# EAGLE design PiHAT_SSR_V4 (EAGLE 9.2.2)

## Sheet 1 of 4: Raspberry Pi GPIO pin layout schematc
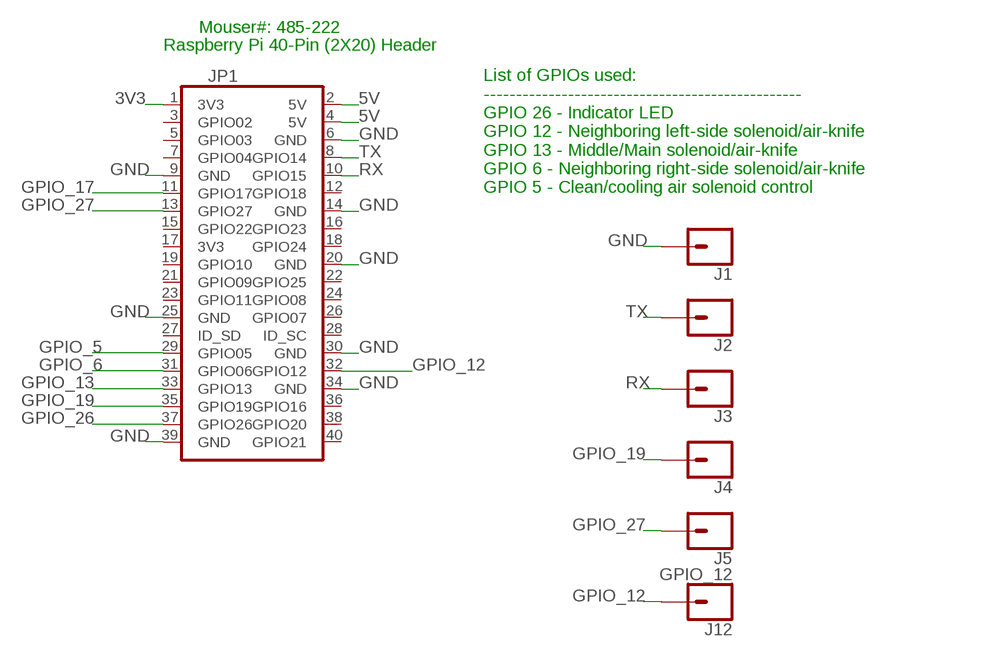
[diagram p0: schematic, sheet 1]

### Parts
J1  CONN_01  [1X01]
J2  CONN_01  [1X01]
J3  CONN_01  [1X01]
J4  CONN_01  [1X01]
J5  CONN_01  [1X01]
J12  GPIO_12  CONN_01  [1X01]
JP1  40W_PI_HAT_TPH  [2X20]

### Nets
3V3: JP1.1(3V3) ; also sheet 2
5V: JP1.2(5V) JP1.4(5V) ; also sheet 3
GND: J1.1 JP1.6(GND) JP1.9(GND) JP1.14(GND) JP1.20(GND) JP1.25(GND) JP1.30(GND) JP1.34(GND) JP1.39(GND) ; also sheet 2,3,4
GPIO_5: JP1.29(GPIO05) ; also sheet 2
GPIO_6: JP1.31(GPIO06) ; also sheet 2
GPIO_12: J12.1 JP1.32(GPIO12)
GPIO_13: JP1.33(GPIO13) ; also sheet 2
GPIO_17: JP1.11(GPIO17) ; also sheet 2
GPIO_19: J4.1 JP1.35(GPIO19)
GPIO_26: JP1.37(GPIO26)
GPIO_27: J5.1 JP1.13(GPIO27)
RX: J3.1 JP1.10(GPIO15)
TX: J2.1 JP1.8(GPIO14)
Unconnected: JP1.3(GPIO02) JP1.5(GPIO03) JP1.7(GPIO04) JP1.12(GPIO18) JP1.15(GPIO22) JP1.16(GPIO23) JP1.17(3V3) JP1.18(GPIO24) JP1.19(GPIO10) JP1.21(GPIO09) JP1.22(GPIO25) JP1.23(GPIO11) JP1.24(GPIO08) JP1.26(GPIO07) JP1.27(ID_SD) JP1.28(ID_SC) JP1.36(GPIO16) JP1.38(GPIO20) JP1.40(GPIO21)

### Notes on the sheet
- Mouser#: 485-222
- Raspberry Pi 40-Pin (2X20) Header
- List of GPIOs used:
  -------------------------------------------------
  GPIO 26 - Indicator LED
  GPIO 12 - Neighboring left-side solenoid/air-knife
  GPIO 13 - Middle/Main solenoid/air-knife
  GPIO 6 - Neighboring right-side solenoid/air-knife
  GPIO 5 - Clean/cooling air solenoid control

## Sheet 2 of 4: Solid State Relay layout
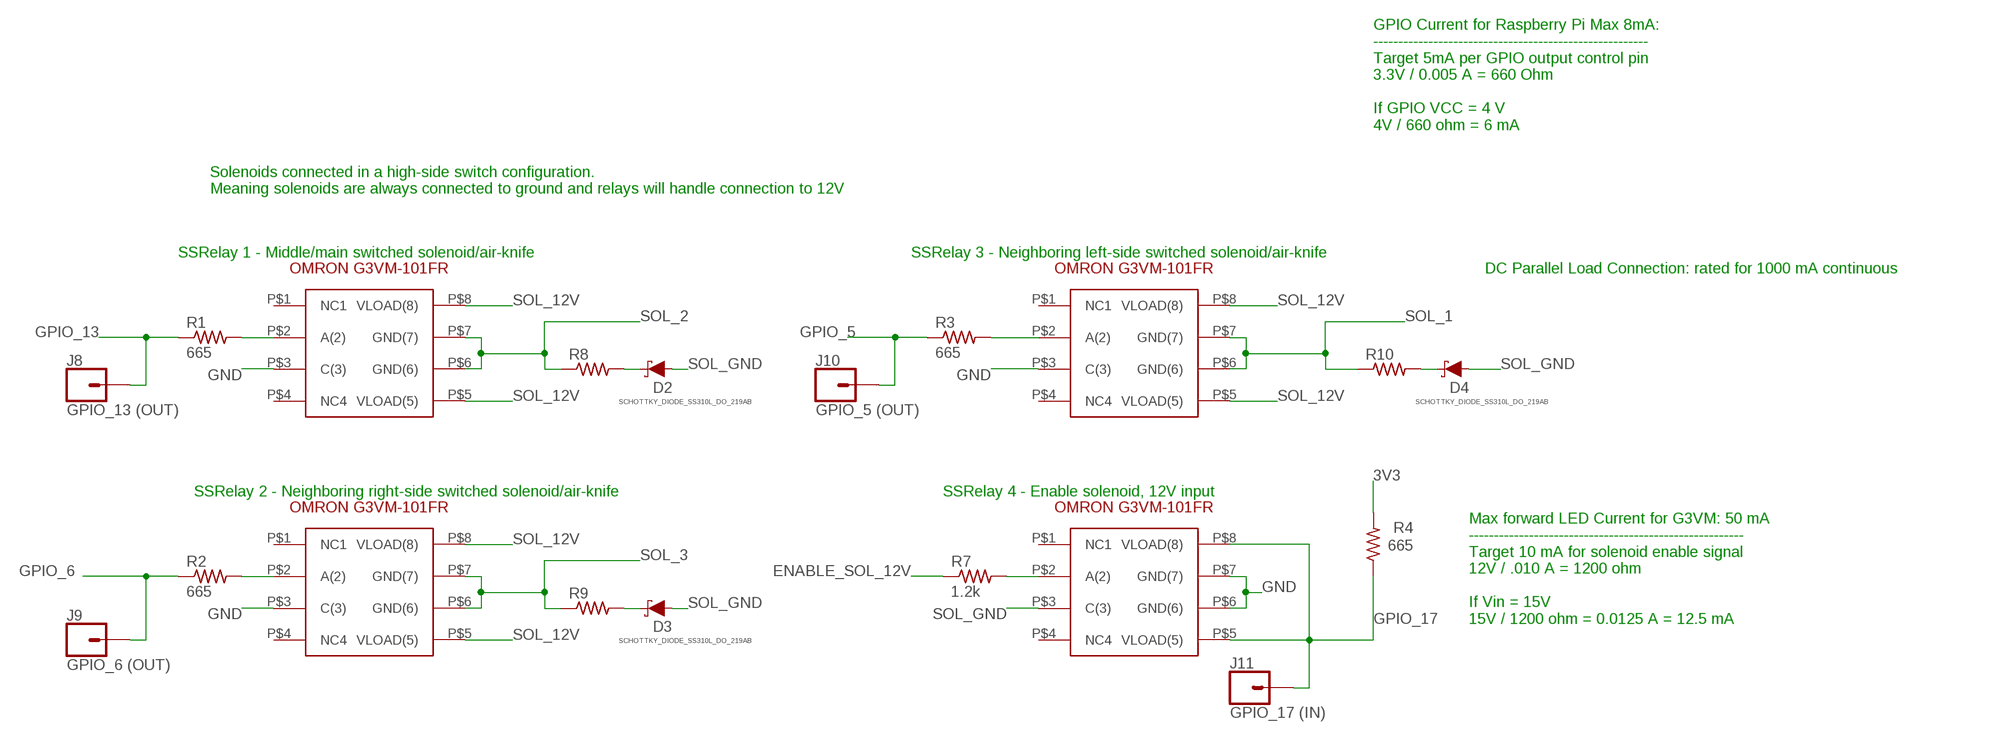
[diagram p1: schematic, sheet 2]

### Parts
D2  SCHOTTKY_DIODE_SS310L_DO_219AB  [SCHOTTKY_DIODE_DO219AB]
D3  SCHOTTKY_DIODE_SS310L_DO_219AB  [SCHOTTKY_DIODE_DO219AB]
D4  SCHOTTKY_DIODE_SS310L_DO_219AB  [SCHOTTKY_DIODE_DO219AB]
J8  GPIO_13 (OUT)  CONN_01  [1X01]
J9  GPIO_6 (OUT)  CONN_01  [1X01]
J10  GPIO_5 (OUT)  CONN_01  [1X01]
J11  GPIO_17 (IN)  CONN_01  [1X01]
R1  665  R-US_M0805  [M0805]
R2  665  R-US_M0805  [M0805]
R3  665  R-US_M0805  [M0805]
R4  665  R-US_M0805  [M0805]
R7  1.2k  R-US_M0805  [M0805]
R8  R-US_R2512  [R2512]
R9  R-US_R2512  [R2512]
R10  R-US_R2512  [R2512]
SSR1  OMRON_G3VM_101FR  [OMRON_G3VM-101FR]
SSR2  OMRON_G3VM_101FR  [OMRON_G3VM-101FR]
SSR3  OMRON_G3VM_101FR  [OMRON_G3VM-101FR]
SSR4  OMRON_G3VM_101FR  [OMRON_G3VM-101FR]

### Nets
3V3: R4.2 ; also sheet 1
ENABLE_SOL_12V: R7.1 ; also sheet 4
GND: SSR1.P$3(C(3)) SSR2.P$3(C(3)) SSR3.P$3(C(3)) SSR4.P$6(GND(6)) SSR4.P$7(GND(7)) ; also sheet 1,3,4
GPIO_5: J10.1 R3.1 ; also sheet 1
GPIO_6: J9.1 R2.1 ; also sheet 1
GPIO_13: J8.1 R1.1 ; also sheet 1
GPIO_17: J11.1 R4.1 SSR4.P$5(VLOAD(5)) SSR4.P$8(VLOAD(8)) ; also sheet 1
N$1: D2.P$2(C) R8.2
N$2: R3.2 SSR3.P$2(A(2))
N$3: D3.P$2(C) R9.2
N$4: R2.2 SSR2.P$2(A(2))
N$5: R1.2 SSR1.P$2(A(2))
N$6: R7.2 SSR4.P$2(A(2))
N$7: D4.P$2(C) R10.2
SOL_1: R10.1 SSR3.P$6(GND(6)) SSR3.P$7(GND(7)) ; also sheet 4
SOL_2: R8.1 SSR1.P$6(GND(6)) SSR1.P$7(GND(7)) ; also sheet 4
SOL_3: R9.1 SSR2.P$6(GND(6)) SSR2.P$7(GND(7)) ; also sheet 4
SOL_12V: SSR1.P$5(VLOAD(5)) SSR1.P$8(VLOAD(8)) SSR2.P$5(VLOAD(5)) SSR2.P$8(VLOAD(8)) SSR3.P$5(VLOAD(5)) SSR3.P$8(VLOAD(8)) ; also sheet 4
SOL_GND: D2.P$1(A) D3.P$1(A) D4.P$1(A) SSR4.P$3(C(3)) ; also sheet 4
Unconnected: SSR1.P$1(NC1) SSR1.P$4(NC4) SSR2.P$1(NC1) SSR2.P$4(NC4) SSR3.P$1(NC1) SSR3.P$4(NC4) SSR4.P$1(NC1) SSR4.P$4(NC4)

### Notes on the sheet
- GPIO Current for Raspberry Pi Max 8mA:
  -------------------------------------------------------
  Target 5mA per GPIO output control pin
  3.3V / 0.005 A = 660 Ohm
  
  If GPIO VCC = 4 V
  4V / 660 ohm = 6 mA
- Solenoids connected in a high-side switch configuration.
  Meaning solenoids are always connected to ground and relays will handle connection to 12V
- SSRelay 1 - Middle/main switched solenoid/air-knife | SSRelay 3 - Neighboring left-side switched solenoid/air-knife
- DC Parallel Load Connection: rated for 1000 mA continuous
- SSRelay 2 - Neighboring right-side switched solenoid/air-knife | SSRelay 4 - Enable solenoid, 12V input
- Max forward LED Current for G3VM: 50 mA
  -------------------------------------------------------
  Target 10 mA for solenoid enable signal
  12V / .010 A = 1200 ohm
  
  If Vin = 15V
  15V / 1200 ohm = 0.0125 A = 12.5 mA

## Sheet 3 of 4: 12V-5V Voltage regulator
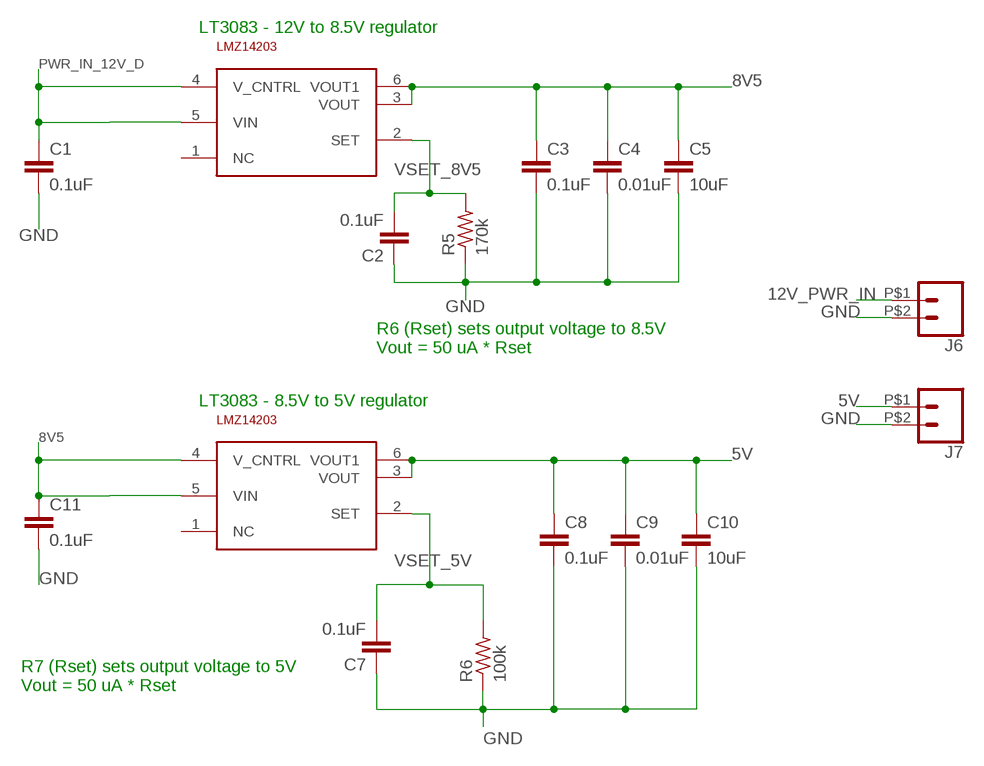
[diagram p2: schematic, sheet 3]

### Parts
C1  0.1uF  C-EUC0805  [C0805]
C2  0.1uF  C-EUC0805  [C0805]
C3  0.1uF  C-EUC0805  [C0805]
C4  0.01uF  C-EUC0805  [C0805]
C5  10uF  C-EUC0805  [C0805]
C7  0.1uF  C-EUC0805  [C0805]
C8  0.1uF  C-EUC0805  [C0805]
C9  0.01uF  C-EUC0805  [C0805]
C10  10uF  C-EUC0805  [C0805]
C11  0.1uF  C-EUC0805  [C0805]
J6  CONN_02PTH2  [1X02_BIG]
J7  CONN_02PTH2  [1X02_BIG]
R5  170k  R-US_M0805  [M0805]
R6  100k  R-US_M0805  [M0805]
VR1  SMD-SPECIAL_28PIN_PIC32_11_3_2011_LT3083  [SMD-SPECIAL_28PIN_PIC32_11_3_2011_DPAK-5]
VR2  SMD-SPECIAL_28PIN_PIC32_11_3_2011_LT3083  [SMD-SPECIAL_28PIN_PIC32_11_3_2011_DPAK-5]

### Nets
5V: C8.1 C9.1 C10.1 J7.P$1 VR2.3(VOUT) VR2.6(VOUT1) ; also sheet 1
8V5: C3.1 C4.1 C5.1 C11.1 VR1.3(VOUT) VR1.6(VOUT1) VR2.4(V_CNTRL) VR2.5(VIN)
12V_PWR_IN: J6.P$1 ; also sheet 4
GND: C1.2 C2.1 C3.2 C4.2 C5.2 C7.1 C8.2 C9.2 C10.2 C11.2 J6.P$2 J7.P$2 R5.1 R6.1 ; also sheet 1,2,4
PWR_IN_12V_D: C1.1 VR1.4(V_CNTRL) VR1.5(VIN) ; also sheet 4
VSET_5V: C7.2 R6.2 VR2.2(SET)
VSET_8V5: C2.2 R5.2 VR1.2(SET)
Unconnected: VR1.1(NC) VR2.1(NC)

### Notes on the sheet
- LT3083 - 12V to 8.5V regulator
- R6 (Rset) sets output voltage to 8.5V
  Vout = 50 uA * Rset
- LT3083 - 8.5V to 5V regulator
- R7 (Rset) sets output voltage to 5V
  Vout = 50 uA * Rset

## Sheet 4 of 4: M12 Connector
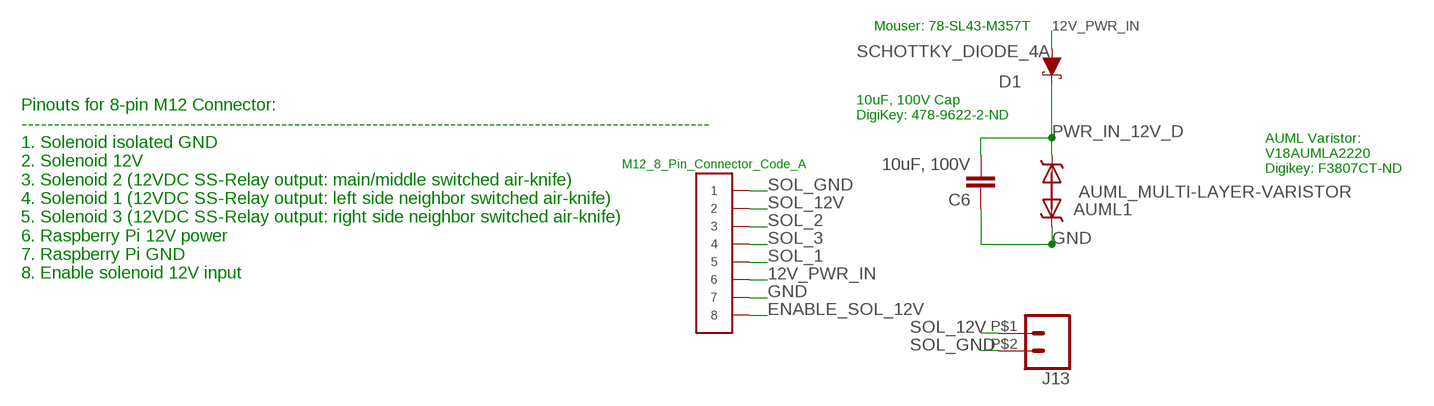
[diagram p3: schematic, sheet 4]

### Parts
AUML1  SMD-SPECIAL_28PIN_PIC32_11_3_2011_MOD5_20_13_AUML_MULTI-LAYER-VARISTOR  [SMD-SPECIAL_28PIN_PIC32_11_3_2011_MOD5_20_13_SMT_CAP_2220]
C6  10uF, 100V  C-EUC2220K  [C2220K]
CN1  M12_8PIN_CODE_A  [M12_8PIN_CODE_A]
D1  SCHOTTKY_DIODE_4A  [SCHOTTKY_DIODE_SMD_DO-214AB]
J13  CONN_02PTH2  [1X02_BIG]

### Nets
12V_PWR_IN: CN1.P$6 D1.P$2(A) ; also sheet 3
ENABLE_SOL_12V: CN1.P$8 ; also sheet 2
GND: AUML1.1 C6.1 CN1.P$7 ; also sheet 1,2,3
PWR_IN_12V_D: AUML1.2 C6.2 D1.P$1(C) ; also sheet 3
SOL_1: CN1.P$5 ; also sheet 2
SOL_2: CN1.P$3 ; also sheet 2
SOL_3: CN1.P$4 ; also sheet 2
SOL_12V: CN1.P$2 J13.P$1 ; also sheet 2
SOL_GND: CN1.P$1 J13.P$2 ; also sheet 2

### Notes on the sheet
- Mouser: 78-SL43-M357T
- 10uF, 100V Cap
  DigiKey: 478-9622-2-ND
- AUML Varistor:
  V18AUMLA2220
  Digikey: F3807CT-ND
- AUML_MULTI-LAYER-VARISTOR
- Pinouts for 8-pin M12 Connector:
  ----------------------------------------------------------------------------------------------------------
  1. Solenoid isolated GND
  2. Solenoid 12V
  3. Solenoid 2 (12VDC SS-Relay output: main/middle switched air-knife)
  4. Solenoid 1 (12VDC SS-Relay output: left side neighbor switched air-knife)
  5. Solenoid 3 (12VDC SS-Relay output: right side neighbor switched air-knife)
  6. Raspberry Pi 12V power
  7. Raspberry Pi GND
  8. Enable solenoid 12V input

## Library data of the parts
AUML1 = VIPR_Components:SMD-SPECIAL_28PIN_PIC32_11_3_2011_MOD5_20_13_AUML_MULTI-LAYER-VARISTOR: V18AUMLA2220: 18V cont, 24.5V (5min. jump starts), 25Joule load dump, 40V max Clamp voltage
C1-C11 = rcl:C-EU: CAPACITOR, European symbol; SPICEPREFIX: C
CN1 = VIPR_Components:M12_8PIN_CODE_A
D1 = VIPR_Components:SCHOTTKY_DIODE_4A
D2-D4 = VIPR_Components:SCHOTTKY_DIODE_SS310L_DO_219AB
J1-J5 J8-J12 = VIPR_Components:CONN_01: Single connection point. Often used as Generic Header-pin footprint for 0.1 inch spaced/style header connections On any of the 0.1 inch spaced packages, you can populate with these: Break Away Headers - Straight <https://www.sparkfun.com/products/116> (PRT-00116) Break Away Male Headers - Right Angle <https://www.sparkfun.com/products/553> (PRT-00553) Female Headers <https://www.sparkfun.com/products/115> (PRT-00115) Break Away Headers - Machine Pin <https://www.sparkfun.com/products/117> (PRT-00117) Break Away Female Headers - Swiss Machine Pin <https://www.sparkfun.com/products/743> (PRT-00743) This device is also useful as a general connection point to wire up your design to another part of your project. Our various solder wires solder well into these plated through hole pads. Hook-Up Wire - Assortment (Stranded, 22 AWG) <https://www.sparkfun.com/products/11375> (PRT-11375) Hook-Up Wire - Assortment (Solid Core, 22 AWG) <https://www.sparkfun.com/products/11367> (PRT-11367) View the entire wire category on our website here <https://www.sparkfun.com/categories/141> Special notes: SMTSO-256-ET is a "flush mount" nut for a 4-40 screw. We mostly use this on specialty testbeds; it is a nice way to connect hardware to your PCB at an adjustable hieght. Also note, the SNAP packages are for using a snappable style connector. We sell a baggie of snaps and they are also used on two LilyPad designs: Snap Assortment - 30 pack (male and female) <https://www.sparkfun.com/products/11347> (DEV-11347) LilyPad Arduino SimpleSnap <https://www.sparkfun.com/products/10941> (DEV-10941) LilyPad SimpleSnap Protoboard <https://www.sparkfun.com/products/10940> (DEV-10940)
J6 J7 J13 = VIPR_Components:CONN_02: Multi connection point. Often used as Generic Header-pin footprint for 0.1 inch spaced/style header connections On any of the 0.1 inch spaced packages, you can populate with these: Break Away Headers - Straight <https://www.sparkfun.com/products/116> (PRT-00116) Break Away Male Headers - Right Angle <https://www.sparkfun.com/products/553> (PRT-00553) Female Headers <https://www.sparkfun.com/products/115> (PRT-00115) Break Away Headers - Machine Pin <https://www.sparkfun.com/products/117> (PRT-00117) Break Away Female Headers - Swiss Machine Pin <https://www.sparkfun.com/products/743> (PRT-00743) For SCREWTERMINALS and SPRING TERMINALS visit here: Screw Terimnals on SparkFun.com <https://www.sparkfun.com/search/results?term=Screw+Terminals> (5mm/3.5mm/2.54mm spacing) This device is also useful as a general connection point to wire up your design to another part of your project. Our various solder wires solder well into these plated through hole pads. Hook-Up Wire - Assortment (Stranded, 22 AWG) <https://www.sparkfun.com/products/11375> (PRT-11375) Hook-Up Wire - Assortment (Solid Core, 22 AWG) <https://www.sparkfun.com/products/11367> (PRT-11367) View the entire wire category on our website here <https://www.sparkfun.com/categories/141> Special notes: Molex polarized connector foot print use with: PRT-08233 with associated crimp pins and housings. 2.54_SCREWTERM for use with PRT-10571. 3.5mm Screw Terminal footprints for PRT-08084 5mm Screw Terminal footprints for use with PRT-08432
JP1 = VIPR_Components:40W_PI_HAT_TPH: PIN HEADER
R1-R10 = rcl:R-US_: RESISTOR, American symbol; SPICEPREFIX: R
SSR1-SSR4 = VIPR_Components:OMRON_G3VM_101FR
VR1 VR2 = VIPR_Components:SMD-SPECIAL_28PIN_PIC32_11_3_2011_LT3083

## Board
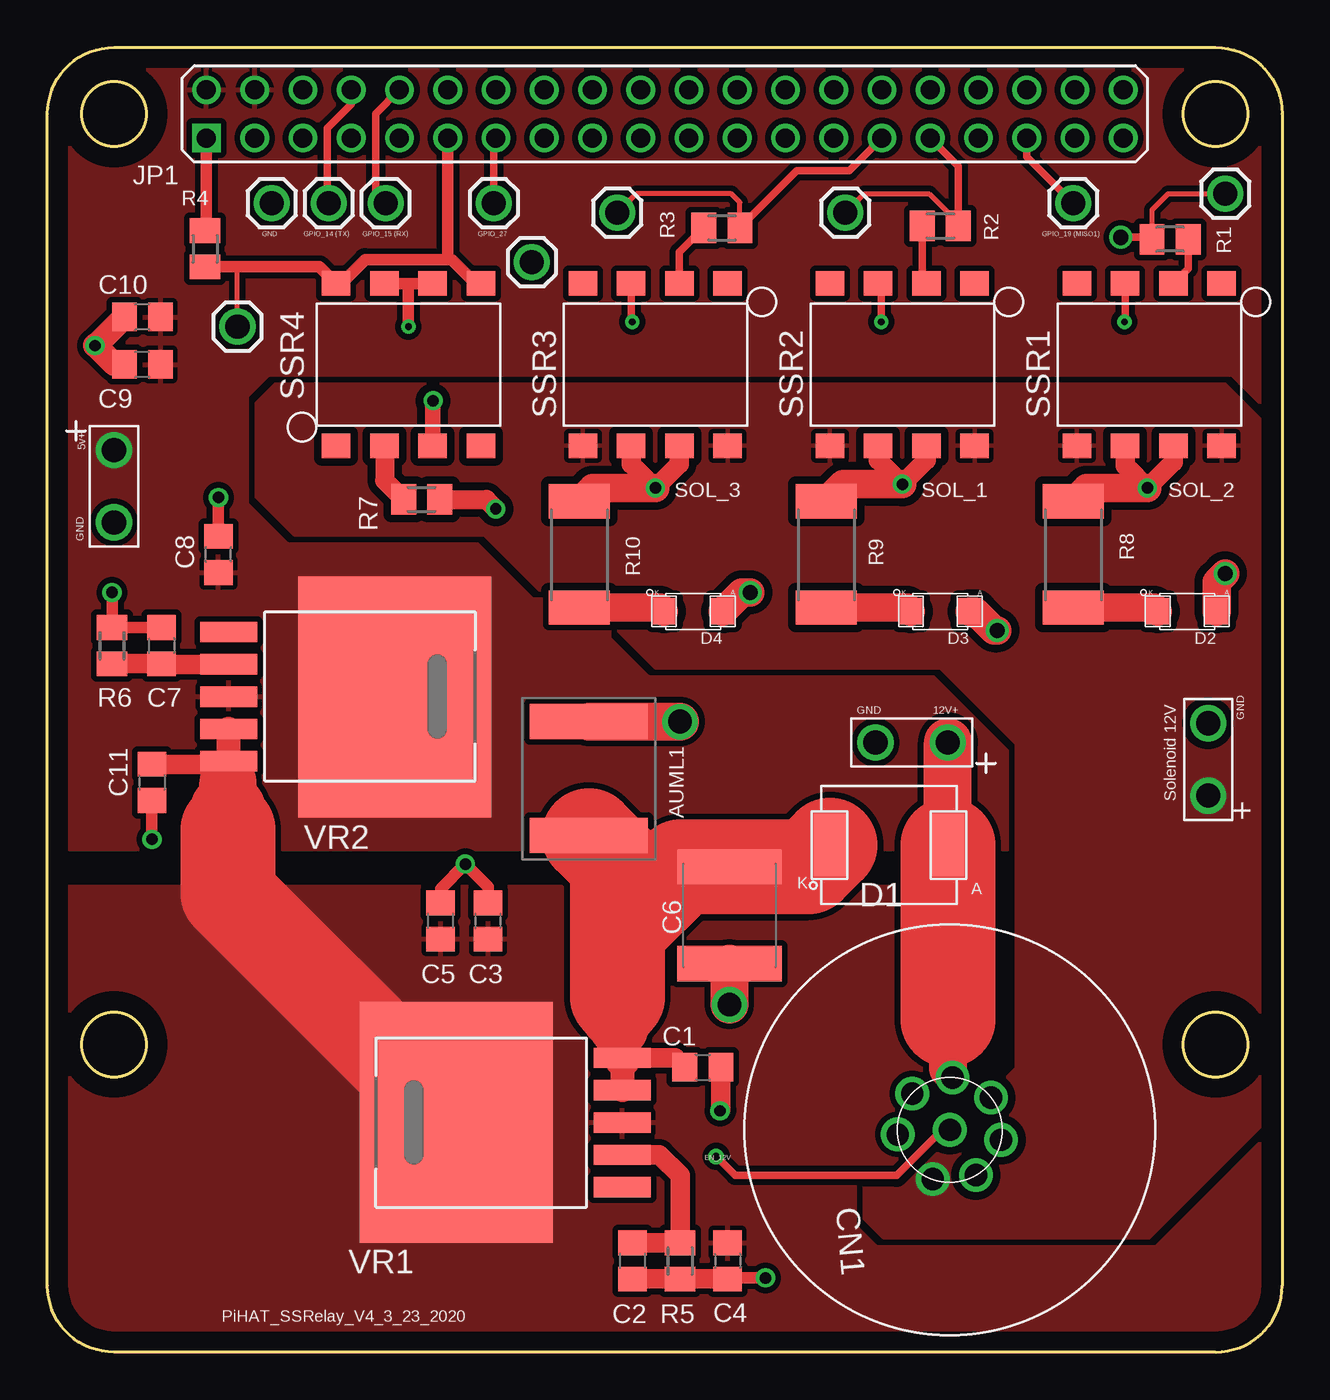
[diagram p4: board, top side]
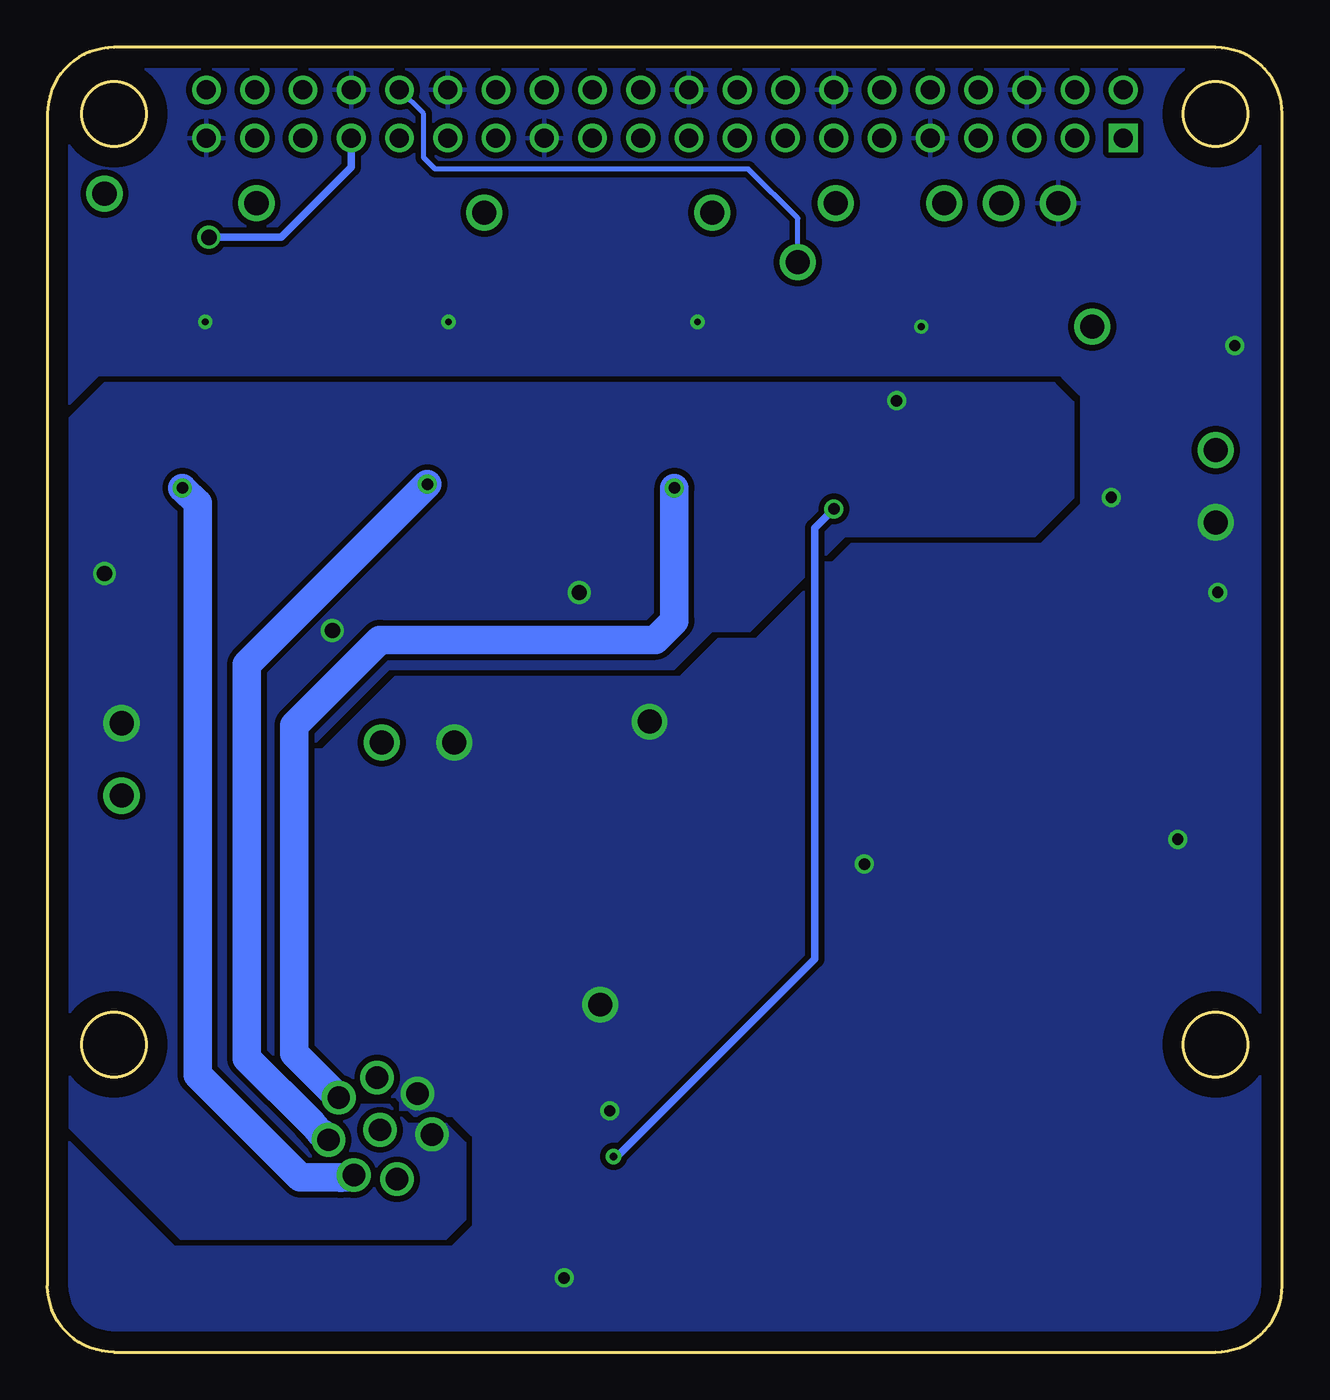
[diagram p5: board, bottom side, seen from below]

Size 65 x 68.7 mm. Coordinates in mm from the lower left corner, seen from the top.
Outline: 0,3.5 0,65.2 arc-90 3.5,68.7 61.5,68.7 arc-90 65,65.2 65,3.5 arc-90 61.5,0 3.5,0 arc-90 0,3.5
Outline: circle at 3.5,16.2 radius 1.7
Outline: circle at 3.5,65.2 radius 1.7
Outline: circle at 61.5,65.2 radius 1.7
Outline: circle at 61.5,16.2 radius 1.7
Copper layers (1*16): Top 0.035mm / dielectric 1.5mm / Bottom 0.035mm
Design rules "default *": minimum track width 10mil, minimum drill 6mil, track to track 12mil, track to pad 12mil, pad to pad 12mil, via to via 12mil, smd to smd 8mil, copper to edge 40mil, drill to drill 8mil, minimum pad ring 10mil, minimum via ring 8mil, stop-mask expansion 4mil, vias tented up to drill 0mil, thermal gap 10mil
tKeepout: area 0,62.7 to 6,68.7; area 59,62.7 to 65,68.7; area 0,12.7 to 6.5,19.2; area 58.5,12.7 to 65,19.2

### Footprints (pad centres in the part's own frame; a part is rotated, then mirrored left to right if it is on the bottom)
SMD-SPECIAL_28PIN_PIC32_11_3_2011_MOD5_20_13_SMT_CAP_2220 = smd 1.85 x 6.2: 1 -3,0; 2 3,0
C0805 = smd 1.3 x 1.5: 1 -0.95,0; 2 0.95,0
C2220K = smd 1.85 x 5.5: 1 -2.55,0; 2 2.55,0
M12_8PIN_CODE_A = drill 1.18: P$1 2.75,0; P$2 1.119,2.512; P$3 -1.162,2.492; P$4 -2.643,0.758; P$5 -2.306,-1.498; P$6 -0.383,-2.723; P$7 1.804,-2.075; P$8 0,0
SCHOTTKY_DIODE_SMD_DO-214AB = smd 1.651 x 3.302: P$1 -3.099,0; P$2 3.099,0
SCHOTTKY_DIODE_DO219AB = smd 1.2 x 1.4: P$1 -1.55,0; P$2 1.55,0
1X01 = drill 1.27: 1 0,0
1X02_BIG = drill 1.27: P$1 0,0; P$2 3.81,0
2X20 = drill 1 square: 1 -24.13,-1.27 | drill 1: 2 -24.13,1.27; 3 -21.59,-1.27; 4 -21.59,1.27; 5 -19.05,-1.27; 6 -19.05,1.27; 7 -16.51,-1.27; 8 -16.51,1.27; 9 -13.97,-1.27; 10 -13.97,1.27; 11 -11.43,-1.27; 12 -11.43,1.27; 13 -8.89,-1.27; 14 -8.89,1.27; 15 -6.35,-1.27; 16 -6.35,1.27; 17 -3.81,-1.27; 18 -3.81,1.27; 19 -1.27,-1.27; 20 -1.27,1.27; 21 1.27,-1.27; 22 1.27,1.27; 23 3.81,-1.27; 24 3.81,1.27; 25 6.35,-1.27; 26 6.35,1.27; 27 8.89,-1.27; 28 8.89,1.27; 29 11.43,-1.27; 30 11.43,1.27; 31 13.97,-1.27; 32 13.97,1.27; 33 16.51,-1.27; 34 16.51,1.27; 35 19.05,-1.27; 36 19.05,1.27; 37 21.59,-1.27; 38 21.59,1.27; 39 24.13,-1.27; 40 24.13,1.27
M0805 = smd 1.3 x 1.6: 1 -0.95,0; 2 0.95,0
R2512 = smd 1.8 x 3.2: 1 -2.8,0; 2 2.8,0
OMRON_G3VM-101FR = smd 1.5 x 1.3: P$1 -3.81,-4.275; P$2 -1.27,-4.275; P$3 1.27,-4.275; P$4 3.81,-4.275; P$5 3.81,4.275; P$6 1.27,4.275; P$7 -1.27,4.275; P$8 -3.81,4.275
SMD-SPECIAL_28PIN_PIC32_11_3_2011_DPAK-5 = smd 1.067 x 2.997: 1 -3.416,-7.468; 2 -1.714,-7.468; 3 -0.013,-7.468; 4 1.689,-7.468; 5 3.391,-7.468 | smd 12.7 x 10.16: 6 0,1.27

### Placement (x,y rotation side)
AUML1  28.5,30.2 270 top
C1  34.5,15 0 top
C2  30.8,4.8 90 top
C3  23.2,22.7 90 top
C4  35.8,4.8 270 top
C5  20.7,22.7 90 top
C6  35.9,23 90 top
C7  6,37.2 270 top
C8  9,42 90 top
C9  5,52 180 top
C10  5,54.5 180 top
C11  5.5,30 270 top
CN1  47.5,11.7 185 top
D1  44.3,26.7 0 top
D2  60,39 180 top
D3  47,39 180 top
D4  34,39 180 top
J1  11.8,60.5 0 top
J2  14.8,60.5 0 top
J3  17.8,60.5 0 top
J4  54,60.5 0 top
J5  23.5,60.5 0 top
J6  47.4,32.1 180 top
J7  3.5,47.5 270 top
J8  62,61 0 top
J9  42,60 0 top
J10  30,60 0 top
J11  10,54 0 top
J12  25.5,57.4 0 top
J13  61.1,29.3 90 top
JP1  32.5,65.2 0 top
R1  59.1,58.6 0 top
R2  47,59.3 180 top
R3  35.5,59.2 180 top
R4  8.3,58.1 90 top
R5  33.3,4.8 90 top
R6  3.4,37.2 270 top
R7  19.7,44.9 180 top
R8  54,42 270 top
R9  41,42 270 top
R10  28,42 270 top
SSR1  58,52 180 top
SSR2  45,52 180 top
SSR3  32,52 180 top
SSR4  19,52 0 top
VR1  22.8,12.1 90 top
VR2  17,34.5 270 top

### Tracks (layer width: path | path; a pad name or v marks a point on that pad's centre or on a via)
3V3
  Top 0.61: JP1.1 8.37,59.12 R4.2
5V
  pour Top (rank 2): 0,26.5 0,68.7 65,68.7 65,26.5
8V5
  Top 1.016: C11.1 9.53,30.95 VR2.5
  Top 1.27: VR2.4 VR2.5 9.53,30 9.5,30
  Top 3: 9.5,28.5 9.5,30
  Top 4: 9.5,28.5 9.5,27.5
  Top 5: 9.5,27.5 9.5,24.13 VR1.6
  pour Top (rank 2): 0,24.5 65,24.5 65,0 0,0
12V_PWR_IN
  Top 1.5: CN1.P$6 47.4,14.69 47.4,14.93
  Top 2: 47.4,17.5 47.4,14.93
  Top 2.54: D1.P$2 J6.P$1
  Top 5: D1.P$2 47.4,17.5
ENABLE_SOL_12V  (via drill 0.4, 0.6)
  Top 0.406: CN1.P$8 47.1,11.7 44.7,9.3 36.2,9.3 v35.2,10.3
  Top 1: R7.1 23.1,44.9 v23.6,44.4
  Bottom 0.406: v23.6,44.4 24.6,43.4 24.6,20.7 35,10.3 v35.2,10.3
GND  (via drill 0.35, 0.6, 1.25)
  Top 0.406: SSR3.P$3 30.73,54.31 v30.79,54.25 | SSR2.P$3 43.89,56.11 v43.89,54.25 | SSR1.P$3 56.73,54.29 v56.69,54.25
  Top 0.61: C8.2 v9,45 | C5.2 20.7,24.4 v22,25.7 23.2,24.5 C3.2 | C7.1 R6.1 v3.4,39.99 v3.4,40 | C11.2 v5.5,27 | v37.8,3.9 35.85,3.9 C4.2 | SSR4.P$7 19,56.27 | 19,56.27 SSR4.P$6 | 19,56.27 v19,54
  Top 1.016: C4.2 R5.1 C2.1 | v35.4,12.7 35.45,12.75 C1.2
  Top 1.27: C10.2 2.55,53 | 2.55,53 v2.5,53 | 2.55,53 3.55,52 C9.2
  Top 2: C6.1 v35.9,18.3 | AUML1.1 v33.3,33.2
  pour Bottom (rank 2): -1,69.2 65.5,69.2 65.5,-0.8 -1,-0.8
GPIO_5
  Top 0.254: R3.1 36.45,60.55 36,61 31,61 J10.1
  Top 0.406: JP1.29 42.2,62.2 39.45,62.2 R3.1
GPIO_6
  Top 0.254: J9.1 43,61 46.41,61 47.95,59.46 R2.1
  Top 0.406: JP1.31 47.95,62.45 R2.1
GPIO_12
  Bottom 0.254: J12.1 25.5,59.7 28.1,62.3 44.6,62.3 45.2,62.9 45.2,65.2 JP1.32
GPIO_13  (via drill 0.8)
  Top 0.254: R1.1 58.15,60.15 59,61 J8.1
  Top 0.406: v56.5,58.7 58.05,58.7 R1.1
  Bottom 0.406: JP1.33 49,62.4 52.7,58.7 v56.5,58.7
GPIO_17
  Top 0.254: J11.1 10,57.15
  Top 0.61: R4.1 10,57.15 14.31,57.15 SSR4.P$8 15.47,56.27 16.73,57.53 21,57.53 | SSR4.P$5 22.53,56.27 21.27,57.53 21,57.53 | JP1.11 21.07,57.6 21,57.53
GPIO_19
  Top 0.406: J4.1 51.55,62.95 JP1.35
GPIO_27
  Top 0.406: J5.1 23.5,63.82 JP1.13
N$1
  Top 1.5: R8.2 58.25,39.2 D2.P$2
N$2
  Top 0.406: R3.2 33.27,57.92 SSR3.P$2
N$3
  Top 1.5: R9.2 45.25,39.2 D3.P$2
N$4
  Top 0.406: R2.2 46.05,56.49 SSR2.P$2
N$5
  Top 0.406: R1.2 60.05,57.05 SSR1.P$2
N$6
  Top 1: SSR4.P$2 17.75,47.7 17.75,45.9 R7.2
N$7
  Top 1.5: R10.2 32.25,39.2 D4.P$2
PWR_IN_12V_D
  Top 1.016: VR1.5 33.06,15.49 C1.1
  Top 1.27: VR1.5 VR1.4
  Top 2: 30.1,17 30.27,16.83 VR1.5
  Top 3: 30,17.9 30,17.1 30.1,17
  Top 4: 30,18.7 30,17.9
  Top 5: D1.P$1 40.05,25.55 C6.2 33.36,25.55 30,22.19 | 30,22.19 30,18.7 | AUML1.2 30,25.7 30,22.19
RX
  Top 0.406: JP1.10 17.27,65.21 17.27,61.08 J3.1
SOL_1  (via drill 0.6)
  Top 1.016: SSR3.P$6 30.73,46.77 v32,45.5 33.27,46.77 SSR3.P$7
  Top 1.5: v32,45.5 28.7,45.5 R10.1
  Bottom 1.5: v32,45.5 32,38.5 33,37.5 47.5,37.5 52,33 52,15.73 CN1.P$5
SOL_2  (via drill 0.6)
  Top 1.016: SSR1.P$7 59.27,46.87 v57.9,45.5 56.73,46.67 SSR1.P$6
  Top 1.5: v57.9,45.5 54.7,45.5 R8.1
  Bottom 1.5: v57.9,45.5 57.1,44.7 57.1,14.6 51.69,9.19 49.81,9.19 49.57,9.17 49.54,9.19 49,9.19 CN1.P$3
SOL_3  (via drill 0.6)
  Top 1.016: SSR2.P$6 43.73,46.97 v45,45.7 46.27,46.97 SSR2.P$7
  Top 1.5: v45,45.7 41.9,45.7 R9.1
  Bottom 1.5: v45,45.7 54.5,36.2 54.5,15.48 51.06,12.04 50.64,11.53 50.55,11.52 CN1.P$4
SOL_12V
  pour Top (isolate 0.406): 43,11 44,12 46,12 47,13 49,13 51,15 51,32 47,36 32,36 30,38 28,38 23,43 13,43 11,45 11,50 12,51 62,51 64,49 64,12 58,6 44,6 43,7
SOL_GND  (via drill 0.6, 0.8)
  Top 0.813: SSR4.P$3 20.27,50.07 v20.3,50.1
  Top 1.5: D4.P$1 36.55,40 v37,40 | D3.P$1 48.85,39 49.85,38 v50,38 | D2.P$1 61.55,40.55 v62,41
  pour Bottom: 43,11 44,12 46,12 47,13 48,13 49,13 50,14 51,15 51,32 49,34 47,36 32,36 30,38 28,38 25,41 23,43 13,43 11,45 11,50 12,51 62,51 64,49 64,12 58,6 44,6 43,7
TX
  Top 0.406: JP1.8 15.99,65.72 14.73,64.45 14.73,60.57 J2.1
VSET_5V
  Top 1.016: VR2.2 6.04,36.22 C7.2 R6.2
VSET_8V5
  Top 1.016: C2.2 R5.2 33.3,9.3 32.22,10.39 VR1.2

### Text on the board
tPlace: 5v+ | GND
tNames: GND | GPIO_14 (TX) | GPIO_15 (RX) | GPIO_27 | GPIO_19 (MISO1) | SOL_3 | SOL_1 | SOL_2 | GND | 12V+ | GND | Solenoid 12V | + | EN_12V | PiHAT_SSRelay_V4_3_23_2020